# Altium schematic sheet Sheet_zadanie_4_V_2.SchDoc
size A4; ApprovedBy: Epshteyn Leonid Borisovich; CheckedBy: Epshteyn Leonid Borisovich; Author: Drogunov Egor Vladimirovich; CompanyName: BINP SB RAS; DrawnBy: Drogunov Egor Vladimirovich; Engineer: Drogunov Egor Vladimirovich; Organization: BINP SB RAS; DocumentNumber: 1; SheetNumber: 1; SheetTotal: 1
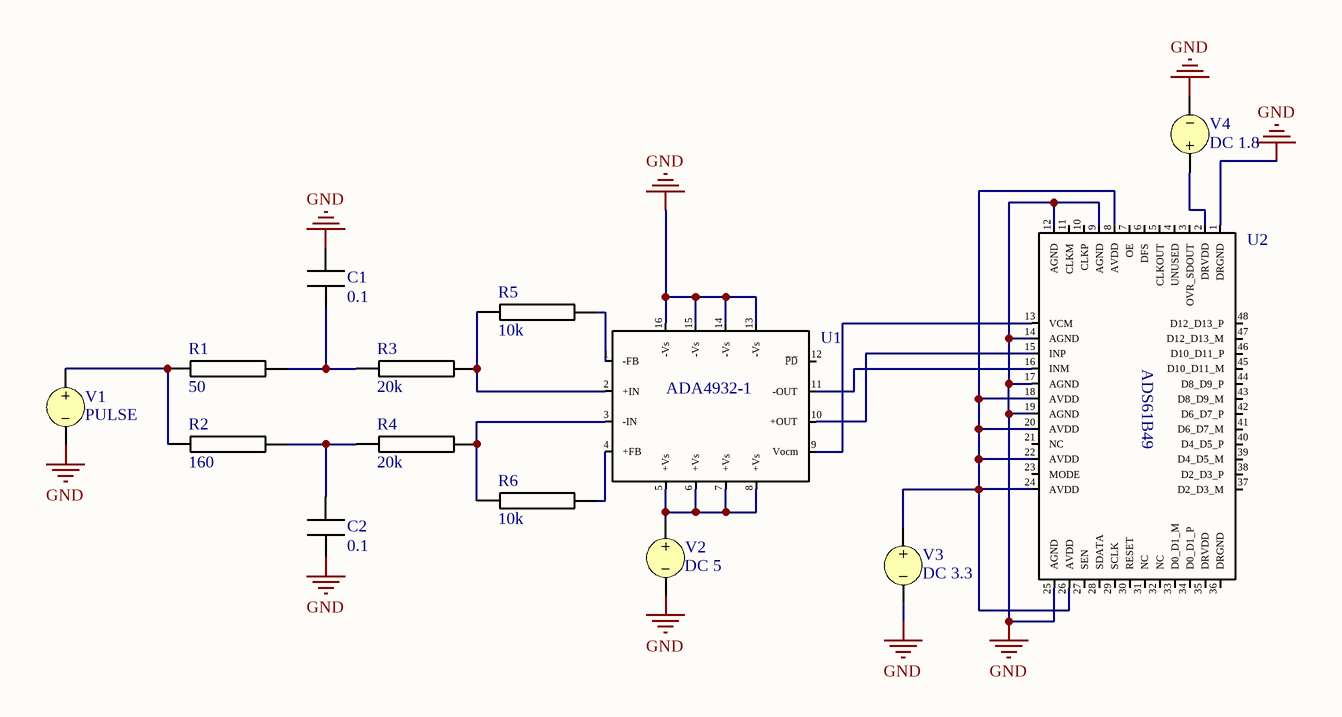
[diagram p0: Sheet_zadanie_4_V_2.SchDoc]

## Parts
C1  Сapacitance: 0.1  (hidden comment: C)
C2  Сapacitance: 0.1  (hidden comment: C)
R1  Resistance: 50  (hidden comment: R)
R2  Resistance: 160  (hidden comment: R)
R3  Resistance: 20k  (hidden comment: R)
R4  Resistance: 20k  (hidden comment: R)
R5  Resistance: 10k  (hidden comment: R)
R6  Resistance: 10k  (hidden comment: R)
U1  U  (value not drawn)
U2  ADС  (value not drawn)
V1  PULSE
V2  DC 5
V3  DC 3.3
V4  DC 1.8

## Nets
GND: C1.?2 C2.?1 U1.13(-Vs) U1.14(-Vs) U1.15(-Vs) U1.16(-Vs) U2.1(DRGND) U2.9(AGND) U2.12(AGND) U2.14(AGND) U2.17(AGND) U2.19(AGND) U2.25(AGND) V1.2 V2.2 V3.2 V4.2
NetC1_?1: C1.?1 R1.?2 R3.?1
NetC2_?2: C2.?2 R2.?2 R4.?1
NetR1_?1: R1.?1 R2.?1 V1.1
NetR3_?2: R3.?2 R5.?2 U1.2(+IN)
NetR4_?2: R4.?2 R6.?2 U1.3(-IN)
NetR5_?1: R5.?1 U1.1(-FB)
NetR6_?1: R6.?1 U1.4(+FB)
NetU1_5: U1.5(+Vs) U1.6(+Vs) U1.7(+Vs) U1.8(+Vs) V2.1
NetU1_9: U1.9(Vocm) U2.13(VCM)
NetU1_10: U1.10(+OUT) U2.15(INP)
NetU1_11: U1.11(-OUT) U2.16(INM)
NetU2_2: U2.2(DRVDD) V4.1
NetU2_8: U2.8(AVDD) U2.18(AVDD) U2.20(AVDD) U2.22(AVDD) U2.24(AVDD) U2.26(AVDD) V3.1

Not connected (* = marked no-connect by the designer): U1 12(P̅D̅); U2 3(OVR_SDOUT) 4(UNUSED) 5(CLKOUT) 6(DFS) 7(OE) 10(CLKP) 11(CLKM) 21(NC) 23(MODE) 27(SEN) 28(SDATA) 29(SCLK) 30(RESET) 31(NC) 32(NC) 33(D0_D1_M) 34(D0_D1_P) 35(DRVDD) 36(DRGND) 37(D2_D3_M) 38(D2_D3_P) 39(D4_D5_M) 40(D4_D5_P) 41(D6_D7_M) 42(D6_D7_P) 43(D8_D9_M) 44(D8_D9_P) 45(D10_D11_M) 46(D10_D11_P) 47(D12_D13_M) 48(D12_D13_P)

## Notes on the sheet
- (in symbol ADС) ADS61B49
- (in symbol U) ADA4932-1

## Library data of the parts
V1 = VSRC: Voltage Source; Note: PCB Footprint - Not required; AC Magnitude: 1; AC Phase: 0; DC Magnitude: 5; Time Delay: 100n; Rise Time: 10n; Pulse Width: 400n; Period: 1u; Published: 8-Jun-2000; LatestRevisionDate: 17-Jul-2002; LatestRevisionNote: Re-released for DXP Platform.; PackageReference: Not Applicable; Publisher: Altium Limited; Initial Value: 0; Pulsed Value: 5; Fall Time: 10n; Phase: 0
V2-V4 = VSRC: Voltage Source; Note: PCB Footprint - Not required; AC Magnitude: 1; AC Phase: 0; Value: 5; Published: 8-Jun-2000; LatestRevisionDate: 17-Jul-2002; LatestRevisionNote: Re-released for DXP Platform.; PackageReference: Not Applicable; Publisher: Altium Limited